# Altium schematic sheet Thermocouples.SchDoc
size A; SheetNumber: 3; SheetTotal: 7
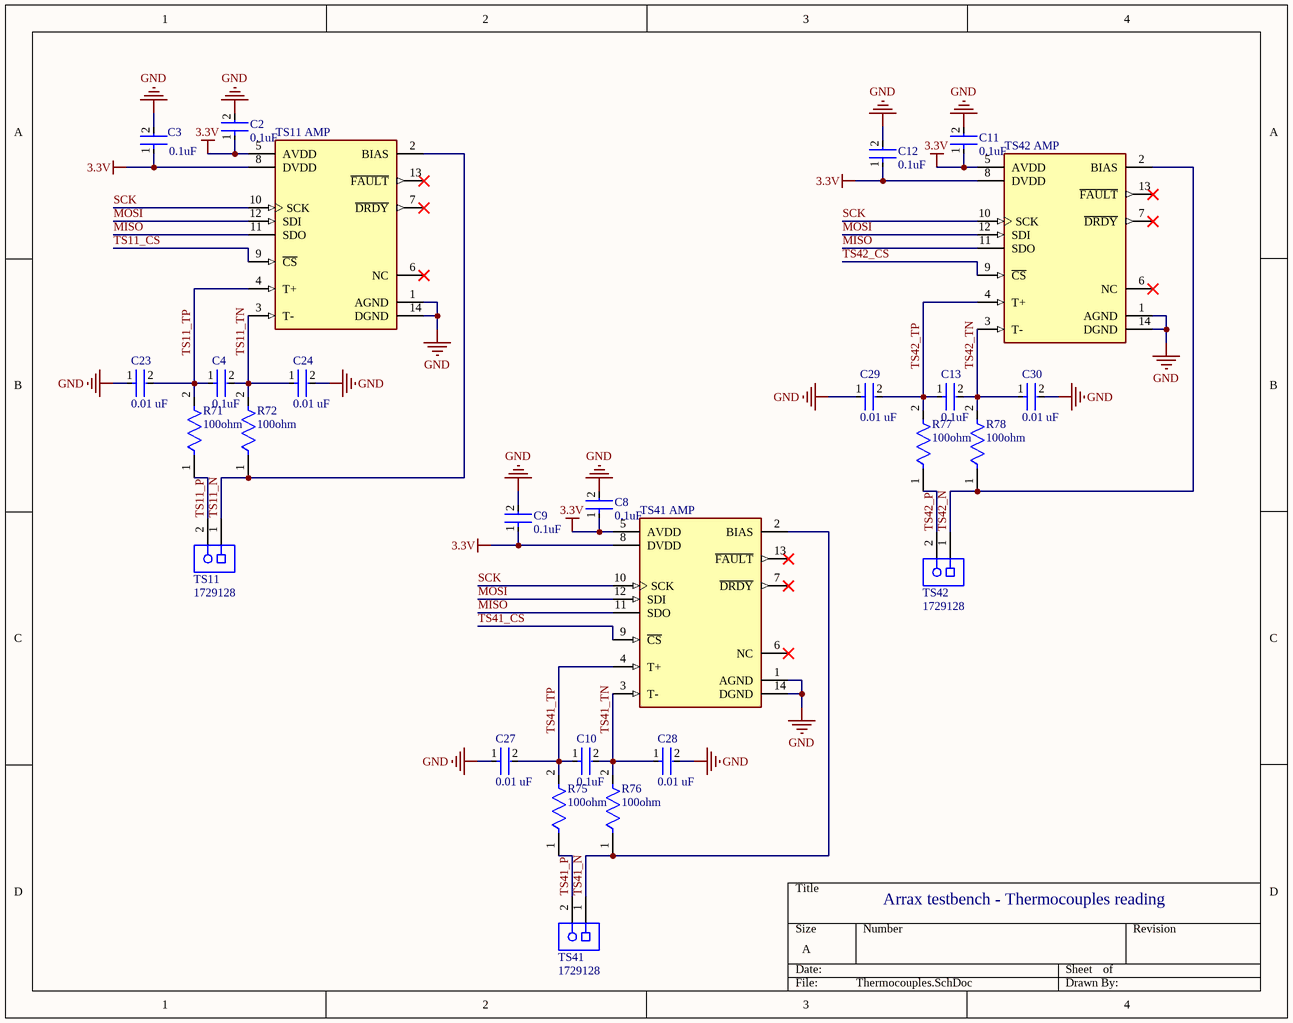
[diagram p0: Thermocouples.SchDoc]

## Parts
C2  0.1uF  [FP-CC0805-0_85-MFG]
C3  0.1uF  [FP-CC0805-0_85-MFG]
C4  0.1uF  [FP-CC0805-0_85-MFG]
C8  0.1uF  [FP-CC0805-0_85-MFG]
C9  0.1uF  [FP-CC0805-0_85-MFG]
C10  0.1uF  [FP-CC0805-0_85-MFG]
C11  0.1uF  [FP-CC0805-0_85-MFG]
C12  0.1uF  [FP-CC0805-0_85-MFG]
C13  0.1uF  [FP-CC0805-0_85-MFG]
C23  0.01 uF  [FP-CC0805-0_85-MFG]
C24  0.01 uF  [FP-CC0805-0_85-MFG]
C27  0.01 uF  [FP-CC0805-0_85-MFG]
C28  0.01 uF  [FP-CC0805-0_85-MFG]
C29  0.01 uF  [FP-CC0805-0_85-MFG]
C30  0.01 uF  [FP-CC0805-0_85-MFG]
R71  100ohm  [FP-RMCF0805-IPC_A]
R72  100ohm  [FP-RMCF0805-IPC_A]
R75  100ohm  [FP-RMCF0805-IPC_A]
R76  100ohm  [FP-RMCF0805-IPC_A]
R77  100ohm  [FP-RMCF0805-IPC_A]
R78  100ohm  [FP-RMCF0805-IPC_A]
TS11  1729128  [PHOE-1729128-2_V]
TS11_AMP  (no value)  [FP-U14-2-MFG]
TS41  1729128  [PHOE-1729128-2_V]
TS41_AMP  (no value)  [FP-U14-2-MFG]
TS42  1729128  [PHOE-1729128-2_V]
TS42_AMP  (no value)  [FP-U14-2-MFG]

## Nets
3.3V: C2.1 C3.1 C8.1 C9.1 C11.1 C12.1 TS11_AMP.5(AVDD) TS11_AMP.8(DVDD) TS41_AMP.5(AVDD) TS41_AMP.8(DVDD) TS42_AMP.5(AVDD) TS42_AMP.8(DVDD)
GND: C2.2 C3.2 C8.2 C9.2 C11.2 C12.2 C23.1 C24.2 C27.1 C28.2 C29.1 C30.2 TS11_AMP.1(AGND) TS11_AMP.14(DGND) TS41_AMP.1(AGND) TS41_AMP.14(DGND) TS42_AMP.1(AGND) TS42_AMP.14(DGND)
MISO: TS11_AMP.11(SDO) TS41_AMP.11(SDO) TS42_AMP.11(SDO)
MOSI: TS11_AMP.12(SDI) TS41_AMP.12(SDI) TS42_AMP.12(SDI)
SCK: TS11_AMP.10(SCK) TS41_AMP.10(SCK) TS42_AMP.10(SCK)
TS11_CS: TS11_AMP.9(~{CS})
TS11_N: R72.1 TS11.1 TS11_AMP.2(BIAS)
TS11_P: R71.1 TS11.2
TS11_TN: C4.2 C24.1 R72.2 TS11_AMP.3(T-)
TS11_TP: C4.1 C23.2 R71.2 TS11_AMP.4(T+)
TS41_CS: TS41_AMP.9(~{CS})
TS41_N: R76.1 TS41.1 TS41_AMP.2(BIAS)
TS41_P: R75.1 TS41.2
TS41_TN: C10.2 C28.1 R76.2 TS41_AMP.3(T-)
TS41_TP: C10.1 C27.2 R75.2 TS41_AMP.4(T+)
TS42_CS: TS42_AMP.9(~{CS})
TS42_N: R78.1 TS42.1 TS42_AMP.2(BIAS)
TS42_P: R77.1 TS42.2
TS42_TN: C13.2 C30.1 R78.2 TS42_AMP.3(T-)
TS42_TP: C13.1 C29.2 R77.2 TS42_AMP.4(T+)

Not connected (* = marked no-connect by the designer): TS11_AMP 6(NC)* 7(~{DRDY})* 13(~{FAULT})*; TS41_AMP 6(NC)* 7(~{DRDY})* 13(~{FAULT})*; TS42_AMP 6(NC)* 7(~{DRDY})* 13(~{FAULT})*

## Notes on the sheet
- Arrax testbench - Thermocouples reading

## Library data of the parts
C2-C4 C8-C13 = CMP-2100-03606-3: CAP CER 0.1UF 50V X7R 0805; Manufacturer Part Number: CC0805KRX7R9BB104; Manufacturer: Yageo; Tolerance: 0.1; Capacitance: 100 nF; Value: 100 nF; Material: Ceramic; Device Class L1: Passive Components; ComponentLink2Description: Datasheet; Package: CC0805-0.85; Digikey Description: CAP CER 0.1UF 50V X7R 0805; Device Class L3: Ceramic Capacitors; Temperature: -30°C to +85°C; Temperature Characteristic: X7R; Voltage Rating: 50 V; Height: 0.95mm; RoHS: TRUE; Ipc Land Pattern Name: CAPC200125X85; Device Class L2: Capacitors; Category: Cap; Temperature Range Low: -30°C; Temperature Range High: +85°C; Mouser Description: Multilayer Ceramic Capacitors MLCC - SMD/SMT 100nF 50V X7R 10%; Footprint Url: http://www.yageo.com/exep/pages/download/literatures/UPY-C_GEN_24.pdf; Automotive: No; Octopart: https://octopart.com/cc0805krx7r9bb104-yageo-192993; Lead Free: Yes; ComponentLink2URL: http://www.yageo.com/documents/recent/UPY-GPHC_Y5V_6.3V-to-50V_8.pdf
C23 C24 C27-C30 = CMP-1036-03842-3: CAP CER 10000PF 50V X7R 0805; Manufacturer: Yageo; Manufacturer Part Number: CC0805KRX7R9BB103; Capacitance: 10 nF; Material: Ceramic; Value: 10 nF; Tolerance: 0.1; Footprint Url: http://www.yageo.com/exep/pages/download/literatures/UPY-C_GEN_24.pdf; Temperature Characteristic: X7R; ComponentLink2Description: Datasheet; Lead Free: Yes; Height: 0.95mm; Temperature Range High: +85°C; Automotive: No; Octopart: https://octopart.com/cc0805krx7r9bb103-yageo-192989; Device Class L1: Passive Components; Mouser Description: Multilayer Ceramic Capacitors MLCC - SMD/SMT 10nF 50V X7R 10%; Temperature: -30°C to +85°C; Device Class L2: Capacitors; Ipc Land Pattern Name: CAPC200125X85; Device Class L3: Ceramic Capacitors; Temperature Range Low: -30°C; RoHS: TRUE; Voltage Rating: 50 V; Package: CC0805-0.85; Category: Cap; ComponentLink2URL: http://www.yageo.com/documents/recent/UPY-GPHC_Y5V_6.3V-to-50V_8.pdf; Digikey Description: CAP CER 10000PF 50V X7R 0805
R71 R72 R75-R78 = CMP-26527-001731-1: 100Ω ±1% 0.125W 0805 Thick Film Chip Resistor AEC-Q200 compliant; Power Rating: 250mW; Temperature Coefficient: 100ppm/°C; Resistance: 100R; Max Power Dissipation: 125mW; Radiation Hardening: No; RoHS Compliant: Yes; Case Code (Imperial): 0805; Depth: 1.25mm; Length: 2mm; Min Operating Temperature: -55°C; Series: RMCF; Packaging: Tape and Reel; Features: Automotive AEC-Q200; Height: 0.026inch; Size Code: 0805; Tolerance: 1%; Number of Terminations: 2; Max Operating Temperature: 155°C; Case/Package: 0805; Width: 0.049inch; Contact Plating: Tin; Resistor Type: Thick Film; Construction: Rectangular; Lead Free: Lead Free; Military Standard: Not; Case Code (Metric): 2012; Mount: Surface Mount
TS11 TS41 TS42 = CMP-2000-05815-1: PCB Terminal Block, 13.5 A, 400 V, 2-Pin THD, RoHS, Bulk; Manufacturer: Phoenix Contact; Package Version: 03/2015; No. of Rows: 1; Pitch: 5.08mm; No. of Positions: 2; Voltage Rating: 400V; Current Rating: 13500mA; Manufacturer URL: http://www.phoenixcontact.com/; Datasheet URL: https://datasheet.ciiva.com/16046/1729128-16046181.pdf; RoHS: TRUE; Package URL: https://www.phoenixcontact.com/online/portal/pi/pxc/product_detail_page/!ut/p/b1/3VdJjqNKFDxLH8AFycySyWY2ozFsEPOMMQaDOX1XedGL_1Vdm5YXJleknhSKeBkvI6EA8ncAo3AYoDhBQGco6KN7VURTdemj9us_IEKEZo_YHiPAEWEFmDGOHMORkqKYCORBZxgL7ZoaZYcbFFUZ3fqxSY6GOuxydWUuHqz1ynmMFygu583Bob0Ewr6Sd_l-5m-kAueHiB0jpRwZwe58wwtkpxtMYd_LmGcDRU02dRNEyWt6Y2ti5pSyJ_reIkzIulrqApdnbT11V5jnCKbYNCvhEM1MCpPByat_X379-iThf08CI5GfOPqfBeS3BRoBOdD55AKVv0iLwCMq-2BrzXWSGRH7pUGD9uwXQjiph3xL0DKQwdGa0JImiIOmBNOestqgwTHSSs2oOep-78apyXQBvNi8ZLaFjvjWvcaUEBu0MC6Wbe-d6mB0FAebo2lUWinqYaZs5DAYzV0RP9yitUjnGJ0iI9xhZkT42OCQNUJJhkgWINNQLP2JFP6OpMg3JCVg70jqHT0lvKOnhHf0lPuOnnLf0VPuWx6_dxwUIvwk5WMkT0kLL1mh61l2yZVSzG3pYV_bqo-mj6uMKwKwdnnW8Jh5RTOJzMOA5c-eJDaZQw4mTMPH02PvS_ZAqNVjVTo2WyYLkwH_KU1mmmG5kjRhDqPXLwwVHvVOjCM60-fpXvTDfMGW1PVFVS1r4e4yVDk4ZdNbkUHvqPqQSeian4UD39fNKmachqdJ1NJbyk8rXT9mXTvPk3oE5meulKGgiruPJek-4I9hTT6G8ZLOyRSm2RRVbThERQad5OS28hdt4YW4vG0stgYYzsWsK4_7y6DZMjJSCqri1kyiZR5vD7pwIrNR7QwPHTcLTI5qT7eRlpHrdGiupYlqQDJ7zy_CND8fWWBoLRXxk1RVcXiBQwbTD4Xi7KL-FuO94t9xaqweXzH; PartNumber: 1729128; Package Description: 2-Pin Through Hole Device, Body 8.1 x 10.16 mm, Pitch 5.08 mm; Datasheet Version: 12/2013; Mounting Technology: ThroughHole; Orientation: Horizontal; Package Reference: 1729128-2; Packing: Bulk
TS11_AMP TS41_AMP TS42_AMP = CMP-05687-000002-1: IC CONV THERMOCOUPLE 14TSSOP; Manufacturer Part Number: MAX31856MUD+T; Manufacturer: Maxim Electronics; Sensor Output: SPI; Max Junction Temp: +150°C; Min Supply Voltage: 3V; Standoff Height: 0.05mm; Max Supply Voltage: 3.6V; Nominal Supply Current: 1.2mA; Automotive: No; Temperature Range Low: -55°C; Device Class L3: Sensor and Detector Interfaces; Temperature Range High: +125°C; Package: U14-2; Sensor Type String: Thermocouple; Ipc Land Pattern Name: SOP65P640X110-14; Temperature: -55°C to +125°C; Device Class L1: Integrated Circuits (ICs); ComponentLink2Description: Datasheet; Digikey Description: IC CONV THERMOCOUPLE 14TSSOP; ComponentLink2URL: https://datasheets.maximintegrated.com/en/ds/MAX31856.pdf; RoHS: TRUE; Device Class L2: Interface ICs; Octopart: https://octopart.com/max31856mud%2Bt-maxim+integrated-51261112; Interface: SPI; Lead Free: Yes; Sensor Input: Thermocouple; Footprint Url: https://pdfserv.maximintegrated.com/land_patterns/90-0113.PDF; Height: 1.1mm; Category: IC